# Altium schematic sheet ChordMaker.SCHDOC
size B; Organization: Altium Limited; Address1: L3, 12a Rodborough Rd; Address2: Frenchs Forest; Address3: NSW; Address4: Australia 2086; DocumentNumber: 9; SheetNumber: 9; SheetTotal: 9
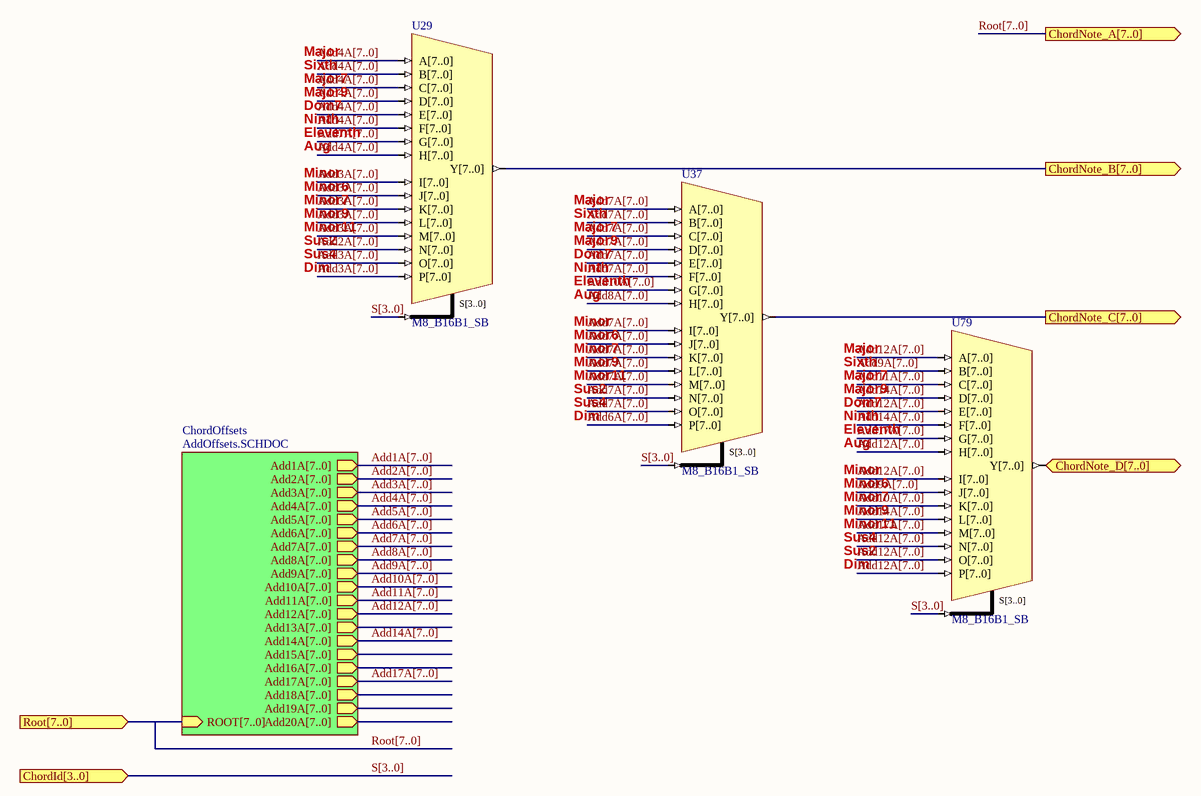
[diagram p0: ChordMaker.SCHDOC]

## Parts
U29  M8_B16B1_SB
U37  M8_B16B1_SB
U79  M8_B16B1_SB

## Sub-sheets
ChordOffsets = AddOffsets.SCHDOC: ROOT[7..0] (in), Add1A[7..0] (out), Add3A[7..0] (out), Add2A[7..0] (out), Add4A[7..0] (out), Add11A[7..0] (out), Add5A[7..0] (out), Add9A[7..0] (out), Add7A[7..0] (out), Add8A[7..0] (out), Add6A[7..0] (out), Add12A[7..0] (out), Add10A[7..0] (out), Add14A[7..0] (out), Add17A[7..0] (out), Add13A[7..0] (out), Add15A[7..0] (out), Add16A[7..0] (out), Add19A[7..0] (out), Add18A[7..0] (out), Add20A[7..0] (out)

## Ports
ChordId[3..0] (in), ChordNote_A[7..0] (out), ChordNote_B[7..0] (out), ChordNote_C[7..0] (out), ChordNote_D[7..0] (out), Root[7..0] (in)

## Nets
Add2A[7..0]: U29.N[7..0] ; sheet ChordOffsets/Add2A[7..0]
Add3A[7..0]: U29.I[7..0] U29.J[7..0] U29.K[7..0] U29.L[7..0] U29.M[7..0] U29.O[7..0] U29.P[7..0] ; sheet ChordOffsets/Add3A[7..0]
Add4A[7..0]: U29.A[7..0] U29.B[7..0] U29.C[7..0] U29.D[7..0] U29.E[7..0] U29.F[7..0] U29.H[7..0] ; sheet ChordOffsets/Add4A[7..0]
Add6A[7..0]: U37.P[7..0] ; sheet ChordOffsets/Add6A[7..0]
Add7A[7..0]: U29.G[7..0] U37.A[7..0] U37.B[7..0] U37.C[7..0] U37.D[7..0] U37.E[7..0] U37.F[7..0] U37.I[7..0] U37.J[7..0] U37.K[7..0] U37.L[7..0] U37.M[7..0] U37.N[7..0] U37.O[7..0] ; sheet ChordOffsets/Add7A[7..0]
Add8A[7..0]: U37.H[7..0] ; sheet ChordOffsets/Add8A[7..0]
Add9A[7..0]: U79.B[7..0] U79.J[7..0] ; sheet ChordOffsets/Add9A[7..0]
Add10A[7..0]: U37.G[7..0] U79.K[7..0] ; sheet ChordOffsets/Add10A[7..0]
Add11A[7..0]: U79.C[7..0] ; sheet ChordOffsets/Add11A[7..0]
Add12A[7..0]: U79.A[7..0] U79.E[7..0] U79.H[7..0] U79.I[7..0] U79.N[7..0] U79.O[7..0] U79.P[7..0] ; sheet ChordOffsets/Add12A[7..0]
Add14A[7..0]: U79.D[7..0] U79.F[7..0] U79.L[7..0] ; sheet ChordOffsets/Add14A[7..0]
Add17A[7..0]: U79.G[7..0] U79.M[7..0] ; sheet ChordOffsets/Add17A[7..0]
ChordNote_B[7..0]: U29.Y[7..0] ; port ChordNote_B[7..0]
ChordNote_C[7..0]: U37.Y[7..0] ; port ChordNote_C[7..0]
ChordNote_D[7..0]: U79.Y[7..0] ; port ChordNote_D[7..0]
S[3..0]: U29.S[3..0] U37.S[3..0] U79.S[3..0] ; port ChordId[3..0]

## Buses and harness runs
bus Add1A[7..0] = sheet ChordOffsets/Add1A[7..0]
bus Add2A[7..0]
bus Add2A[7..0] = sheet ChordOffsets/Add2A[7..0]
bus Add3A[7..0]
bus Add3A[7..0] = sheet ChordOffsets/Add3A[7..0]
bus Add4A[7..0]
bus Add4A[7..0] = sheet ChordOffsets/Add4A[7..0]
bus Add5A[7..0] = sheet ChordOffsets/Add5A[7..0]
bus Add6A[7..0]
bus Add6A[7..0] = sheet ChordOffsets/Add6A[7..0]
bus Add7A[7..0]
bus Add7A[7..0] = sheet ChordOffsets/Add7A[7..0]
bus Add8A[7..0]
bus Add8A[7..0] = sheet ChordOffsets/Add8A[7..0]
bus Add9A[7..0]
bus Add9A[7..0] = sheet ChordOffsets/Add9A[7..0]
bus Add10A[7..0]
bus Add10A[7..0] = sheet ChordOffsets/Add10A[7..0]
bus Add11A[7..0]
bus Add11A[7..0] = sheet ChordOffsets/Add11A[7..0]
bus Add12A[7..0]
bus Add12A[7..0] = sheet ChordOffsets/Add12A[7..0]
bus Add14A[7..0]
bus Add14A[7..0] = sheet ChordOffsets/Add14A[7..0]
bus Add17A[7..0]
bus Add17A[7..0] = sheet ChordOffsets/Add17A[7..0]
bus Root[7..0] = port ChordNote_A[7..0]
bus Root[7..0] = port Root[7..0] = sheet ChordOffsets/ROOT[7..0]
bus S[3..0]
bus S[3..0] = port ChordId[3..0]

## Notes on the sheet
- Major
- Major7
- Sixth
- Dom7
- Major9
- Ninth
- Eleventh
- Aug
- Minor
- Minor6
- Minor7
- Minor9
- (near U29) Major
- (near U29) Sixth
- Sus2
- Sus4
- Minor11
- Dim
- (near U29) Major7
- (near U29) Major9
- (near U29) Ninth
- (near U29) Eleventh
- (near U29) Minor
- (near U29) Minor6
- (near U29) Minor7
- (near U37) Major
- (near U37) Major7
- (near U37) Major9
- (near U37) Sixth
- (near U37) Ninth
- (near U37) Eleventh
- (near U37) Minor
- (near U37) Minor6
- (near U37) Minor7
- Title
- Size:
- Date:
- B
- Number:
- Time:
- Revision:
- Sheet
- of
- File:

## Library data of the parts
U29 U37 U79 = M8_B16B1_SB: 16x8-Bit Bus to 1x8-Bit Bus Multiplexer With Bus Version Select; ArchiveName: GENERIC; Published: 18-Dec-2003; Publisher: Altium Limited; Core Revision: 1.00.00